# Altium schematic sheet Sheet1.SchDoc: Eval M1
size A4; ApprovedBy: Jordan C; Revision: RevA; SheetNumber: 1; SheetTotal: 1
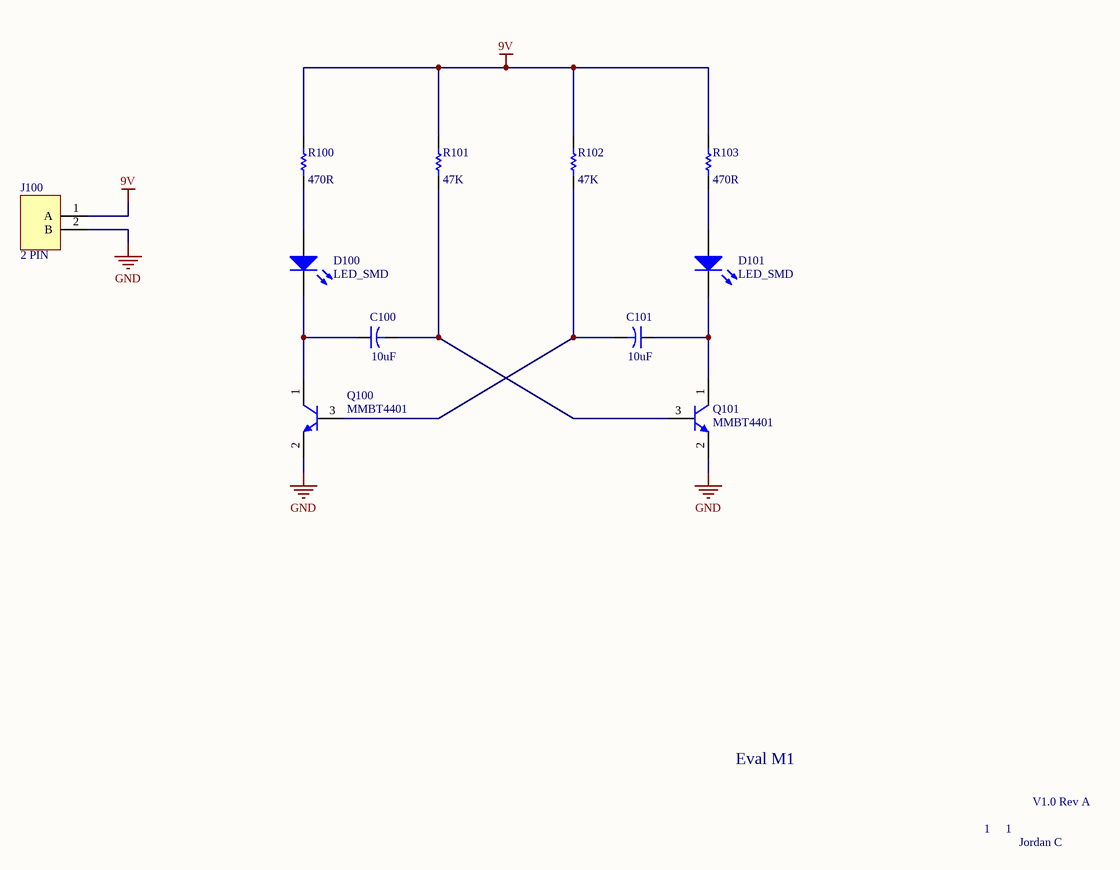
[diagram p0: Sheet1.SchDoc]

## Parts
C100  value 10uF  [CAPR5-4X5]  (hidden comment: Cap2)
C101  value 10uF  [CAPR5-4X5]  (hidden comment: Cap2)
D100  LED_SMD  [0603_LED]
D101  LED_SMD  [0603_LED]
J100  2 PIN  [Header 2_PIN]
Q100  MMBT4401  [SOT23_N]
Q101  MMBT4401  [SOT23_N]
R100  value 470R  [R0603]  (hidden comment: Res1)
R101  value 47K  [R0603]  (hidden comment: Res1)
R102  value 47K  [R0603]  (hidden comment: Res1)
R103  value 470R  [R0603]  (hidden comment: Res1)

## Nets
9V: J100.1(A) R100.1 R101.1 R102.1 R103.1
GND: J100.2(B) Q100.2(E) Q101.2(E)
NetC100_1: C100.1 D100.2(K) Q100.1(C)
NetC100_2: C100.2 Q101.3(B) R101.2
NetC101_1: C101.1 D101.2(K) Q101.1(C)
NetC101_2: C101.2 Q100.3(B) R102.2
NetD100_1: D100.1(A) R100.2
NetD101_1: D101.1(A) R103.2

## Notes on the sheet
- Eval M1
- 1
- V1.0 Rev A
- Jordan C

## Library data of the parts
C100 C101 = Cap2: Capacitor; PackageReference: CAPR5-4X5; PackageDescription: Capacitor; 2 Leads
D100 D101 = LED_SMD: LED RED CLEAR 0603 SMD; Manufacturer Part Number: LTST-C191KRKT; PackageReference: 0603 (1608 Metric); PackageDescription: 1.60mm L x 0.80mm W; Digikey Part Number: 160-1447-1-ND; Value: RED
J100 = Connector_2Pin
Q100 Q101 = NPN: NPN Bipolar Transistor; Manufacturer: ON Semiconductor; Manufacturer Part Number: MMBT4401LT1G; PackageReference: SOT-23-3 (TO-236); PackageDescription: SOT-23-3 (TO-236); Digikey Part Number: MMBT4401LT1GOSCT-ND; Value: MMBT4401
R100-R103 = Res1: Resistor; PackageReference: AXIAL-0.3; PackageDescription: Axial Device, Thru-Hole; 2 Leads; 0.3 in Pin Spacing